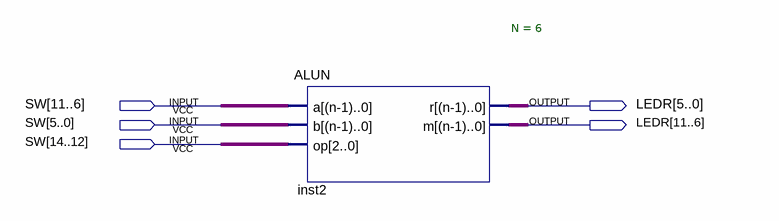
[diagram p0: schematic sheet]
// Quartus schematic ALUDemo.bdf as structural Verilog: 1 symbols, 5 pins
module ALUDemo (
  input  [14:0] SW,
  output [11:0] LEDR
);

  ALUN #(.N(6)) inst2 (.a(SW[11:6]), .b(SW[5:0]), .op(SW[14:12]), .r(LEDR[5:0]), .m(LEDR[11:6]));
endmodule
